# Altium schematic sheet IOTLoRaSmartGreenhouseNode.SchDoc
size A
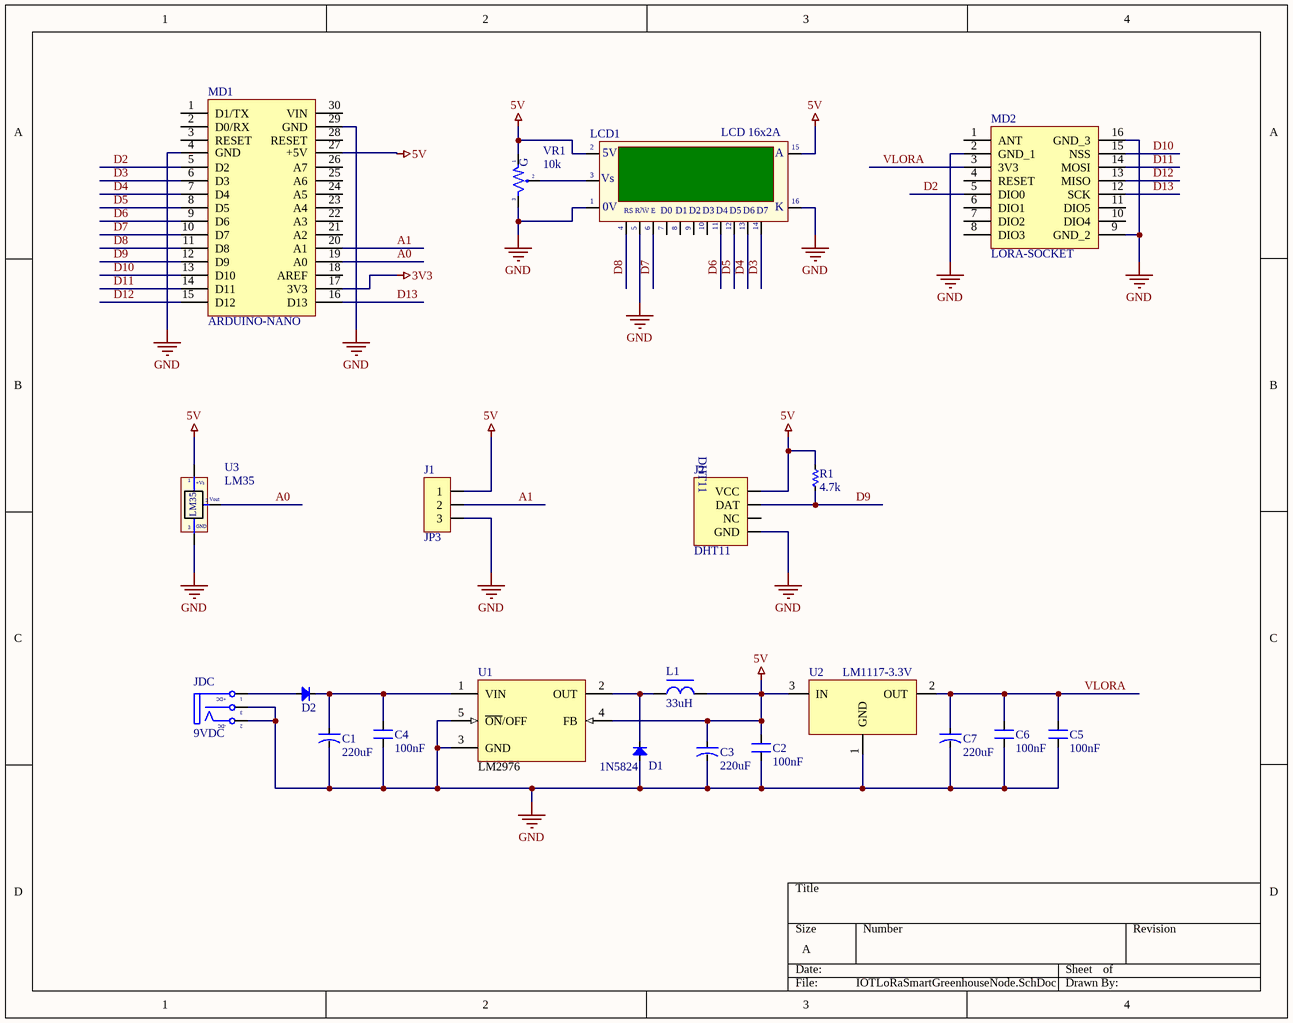
[diagram p0: IOTLoRaSmartGreenhouseNode.SchDoc]

## Parts
C1  220uF  [CA-ALU-8]
C2  100nF  [CN1.5]
C3  220uF  [CA-ALU-8]
C4  100nF  [CN1.5]
C5  100nF  [CN1.5]
C6  100nF  [CN1.5]
C7  220uF  [CA-ALU-8]
D1  1N5824  [DIO-5A]
D2  Diode  [DIO-3A]  (value not drawn)
J1  JP3  [JP3-D1C]
J2  DHT11  [JP4-C1T]
JDC  9VDC  [DC0]
L1  33uH  [L-DIP-M-10]
LCD1  LCD 16x2A  [LCD16X2N]
MD1  ARDUINO-NANO  [ARDUINO-NANO]
MD2  LORA-SOCKET  [LORA-SOCKET]
R1  4.7k  [RES-1/4W]
U1  LM2976  [TO263]
U2  LM1117-3.3V  [SOT223]
U3  LM35  [TO92-123]
VR1  10k  [VR-S2]

## Nets
3V3: MD1.17(3V3)
5V: C2.1 C3.1 J1.1 J2.1(VCC) L1.2 LCD1.2(VDD) LCD1.15(A) MD1.27(+5V) R1.1 U1.4(FB) U2.3(IN) U3.1(+Vs) VR1.1
GND: C1.2 C2.2 C3.2 C4.2 C5.2 C6.2 C7.2 D1.1(A) J1.3 J2.4(GND) JDC.2(TN) JDC.3(S) LCD1.1(GND) LCD1.5(R/~{W}) LCD1.16(K) MD1.4(GND) MD1.29(GND) MD2.2(GND_1) MD2.9(GND_2) MD2.16(GND_3) U1.3(GND) U1.5(~{ON}/OFF) U2.1(GND) U3.3(-) VR1.3
A0: MD1.19(A0) U3.2(Vout)
A1: J1.2 MD1.20(A1)
D2: MD1.5(D2) MD2.5(DIO0)
D3: LCD1.14(D7) MD1.6(D3)
D4: LCD1.13(D6) MD1.7(D4)
D5: LCD1.12(D5) MD1.8(D5)
D6: LCD1.11(D4) MD1.9(D6)
D7: LCD1.6(~{EN}) MD1.10(D7)
D8: LCD1.4(RS) MD1.11(D8)
D9: J2.2(DAT) MD1.12(D9) R1.2
D10: MD1.13(D10) MD2.15(NSS)
D11: MD1.14(D11) MD2.14(MOSI)
D12: MD1.15(D12) MD2.13(MISO)
D13: MD1.16(D13) MD2.12(SCK)
VLORA: C5.1 C6.1 C7.1 MD2.3(3V3) U2.2(OUT)
NetC1_1: C1.1 C4.1 D2.2(K) U1.1(VIN)
NetD1_2: D1.2(K) L1.1 U1.2(OUT)
NetD2_1: D2.1(A) JDC.1(T)
NetLCD1_3: LCD1.3(VEE) VR1.2

Not connected (* = marked no-connect by the designer): J2 3(NC); LCD1 7(D0) 8(D1) 9(D2) 10(D3); MD1 1(D1/TX) 2(D0/RX) 3(RESET) 18(AREF) 21(A2) 22(A3) 23(A4) 24(A5) 25(A6) 26(A7) 28(RESET) 30(VIN); MD2 1(ANT) 4(RESET) 6(DIO1) 7(DIO2) 8(DIO3) 10(DIO4) 11(DIO5)

## Notes on the sheet
- (in symbol DCIN) +DC; -DC
- (in symbol LCD16x2A) 5V; Vs; |; 0V; R/W; E
- (in symbol LM35) GND
- (in symbol VR-S) G

## Library data of the parts
C1 C3 C7 = CN-ALU-DIP: Capacitor (Semiconductor SIM Model); Value: 104; LatestRevisionDate: 17-Jul-2002; LatestRevisionNote: Re-released for DXP Platform.; PackageReference: C1206; Publisher: Altium Limited
C2 C4-C6 = CN: Value: 33pF
D1 D2 = Diode: Default Diode; Code - JEDEC: DO-214-AB; Value: 1N5007; Published: 8-Jun-2000; Revision: July-2002: Re-released for DXP Platform.; Publisher: Altium Limited
J1 = JP3: WR-PHD 2.54 mm Angled Socket Header; Manufacturer: W¨¹rth Elektronik eiSos GmbH; partNo: 613003143121; ComponentLink1 Description: Manufacturer; ComponentLink2 Description: Datasheet; NoPins: 03; Created Date: 29 March 2013; ComponentLink1URL: http://www.we-online.com; ComponentLink2URL: http://katalog.we-online.de/em/datasheet/6130xx143121.pdf; Created by: Karrer Zheng
J2 = DHT11: Manufacturer: W¨¹rth Elektronik eiSos GmbH; partNo: 613004143121; ComponentLink1 Description: Manufacturer; ComponentLink2 Description: Datasheet; NoPins: 04; Created Date: 29 March 2013; ComponentLink1URL: http://www.we-online.com; ComponentLink2URL: http://katalog.we-online.de/em/datasheet/6130xx143121.pdf; Created by: Karrer Zheng
JDC = DCIN: Jac DC input; Value: Jac DC
L1 = L-DIP-1: Inductor; Value: 150 mH
LCD1 = LCD16x2A: LCD dipslay 16 char, 2 line; Value: LCD16x2A
MD1 = ARDUINO-NANO: KIT Arduino Nano
MD2 = LORA-SOCKET: Socket LoRa RA01 va RA02
R1 = Res: Manufacturer: Generic Components; Class: Passive; SubClass: R; Published: 08/06/2000; Publisher: Altium Hobart Technology Centre
U1 = LM2596: Max Input Voltage: 12 V; Max Output Current: 3 (6.0 peak) A; Max Output Voltage: mV; Category: IC-Power; Min Input Voltage: mV; Min Output Voltage: mV; Mounting Technology: Surface Mount; Status: Unreleased; Supply Voltage: mV; Temperature Range: -40 to +125 degC
U2 = LM1117: 800mA Low-Dropout Linear Regulator; Creator: Nguyen Ba Bien; Website: http://group3i.net
U3 = LM35: Teminal; Value: LM35
VR1 = VR-S: Var Resistor; Value: Volume 50k